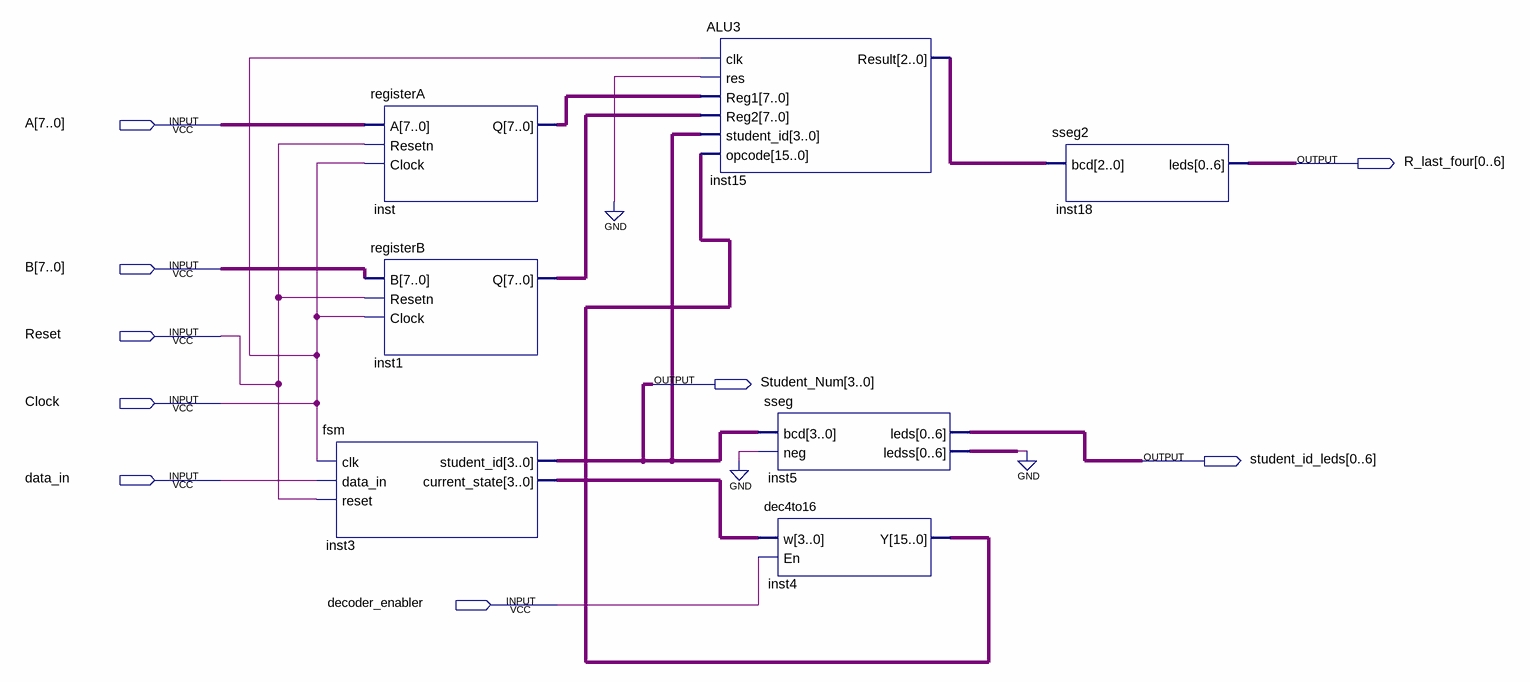
[diagram p0: schematic sheet]
// Quartus schematic Part3.bdf as structural Verilog: 7 symbols, 9 pins
module Part3 (
  input  [7:0] A,
  input  [7:0] B,
  input  Reset,
  input  Clock,
  input  data_in,
  input  decoder_enabler,
  output [0:6] R_last_four,
  output [3:0] Student_Num,
  output [0:6] student_id_leds
);

  wire [2:0] inst15_result;
  wire [3:0] inst3_current_state;
  wire [6:0] inst5_ledss;
  wire [7:0] inst1_q, inst_q;
  wire [15:0] inst4_y;

  fsm inst3 (
    .clk(Clock), .data_in(data_in), .reset(Reset), .student_id(Student_Num),
    .current_state(inst3_current_state));
  registerA inst (.A(A), .Resetn(Reset), .Clock(Clock), .Q(inst_q));
  registerB inst1 (.B(B), .Resetn(Reset), .Clock(Clock), .Q(inst1_q));
  ALU3 inst15 (
    .clk(Clock), .res(1'b0), .Reg1(inst_q), .Reg2(inst1_q), .student_id(Student_Num), .opcode(inst4_y),
    .Result(inst15_result));
  sseg inst5 (.bcd(Student_Num), .neg(1'b0), .leds(student_id_leds), .ledss(inst5_ledss));
  dec4to16 inst4 (.w(inst3_current_state), .En(decoder_enabler), .Y(inst4_y));
  sseg2 inst18 (.bcd(inst15_result), .leds(R_last_four));
endmodule
